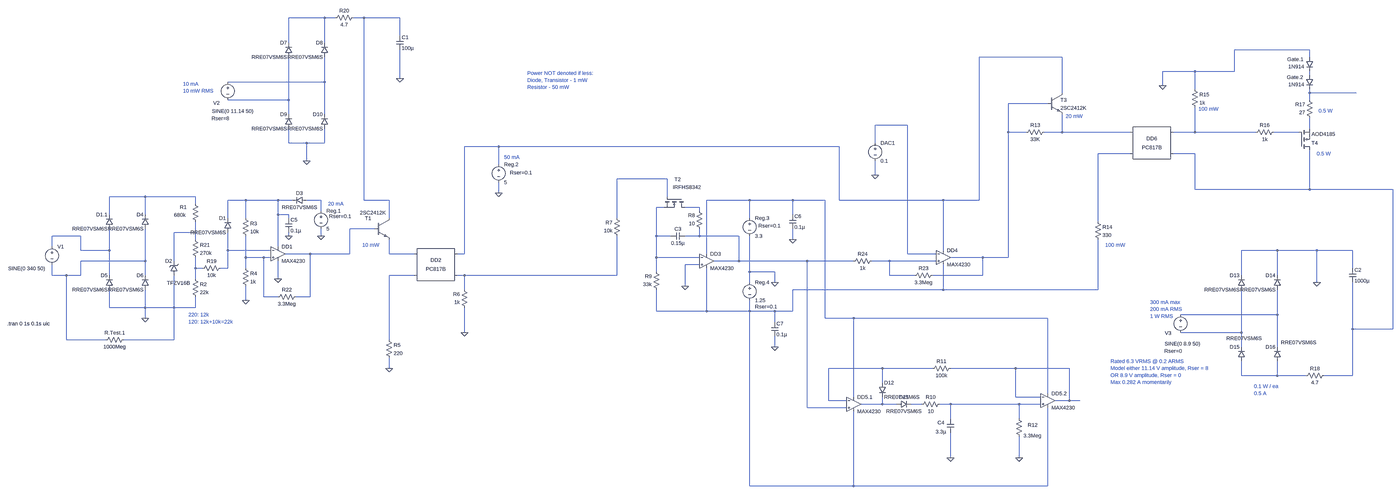
[diagram p0: schematic thyristor.asc, whole sheet]
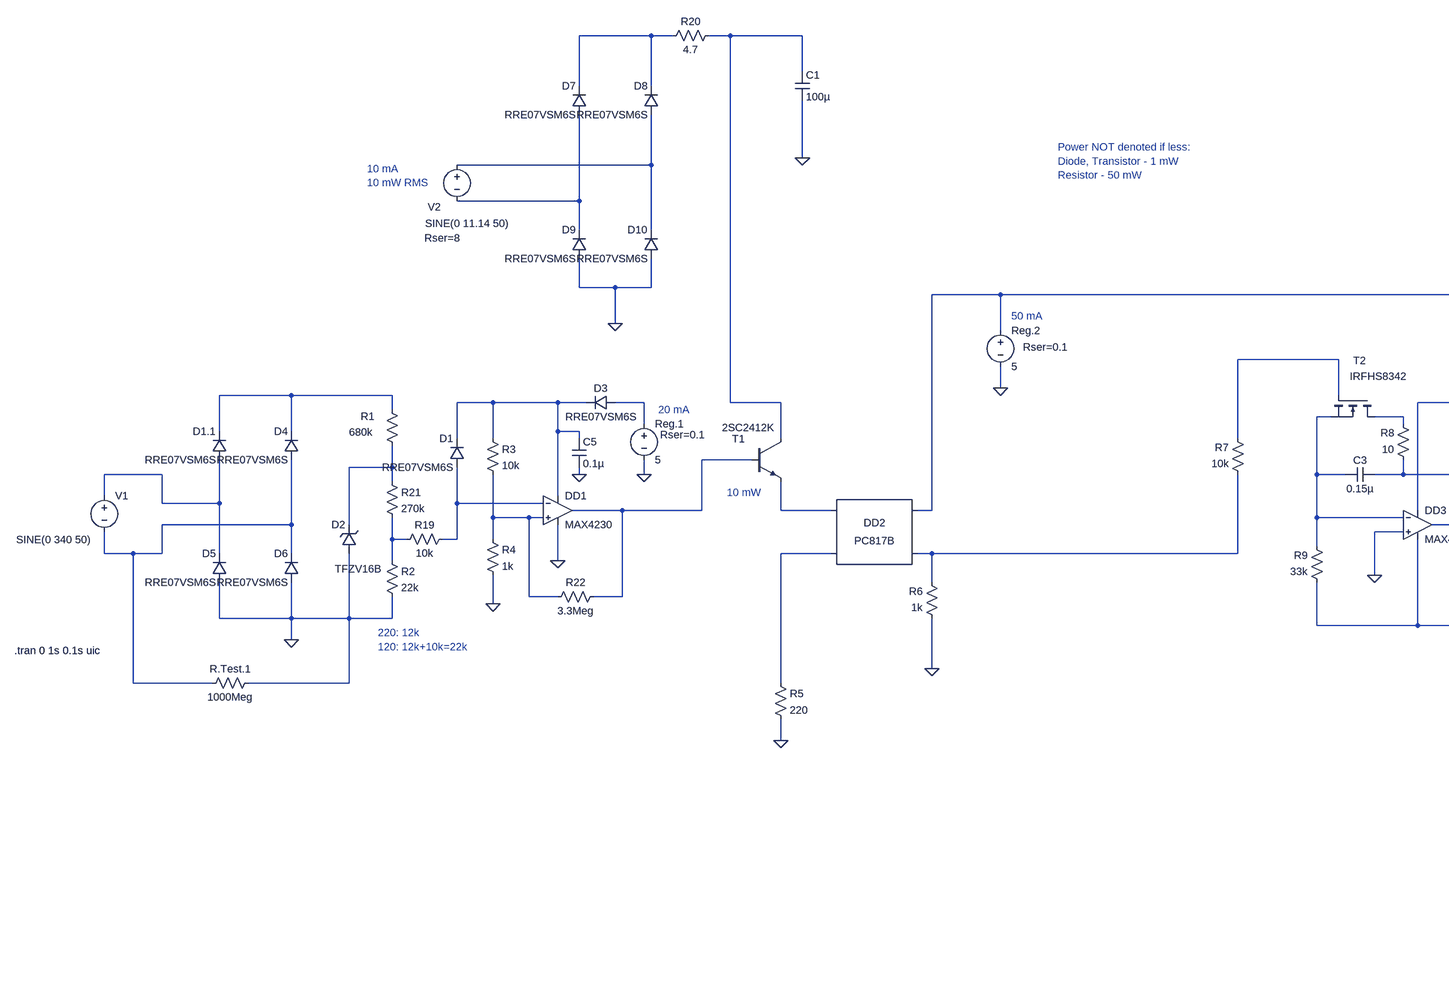
[diagram p1: schematic thyristor.asc, part, row 1 of 1, column 1 of 2]
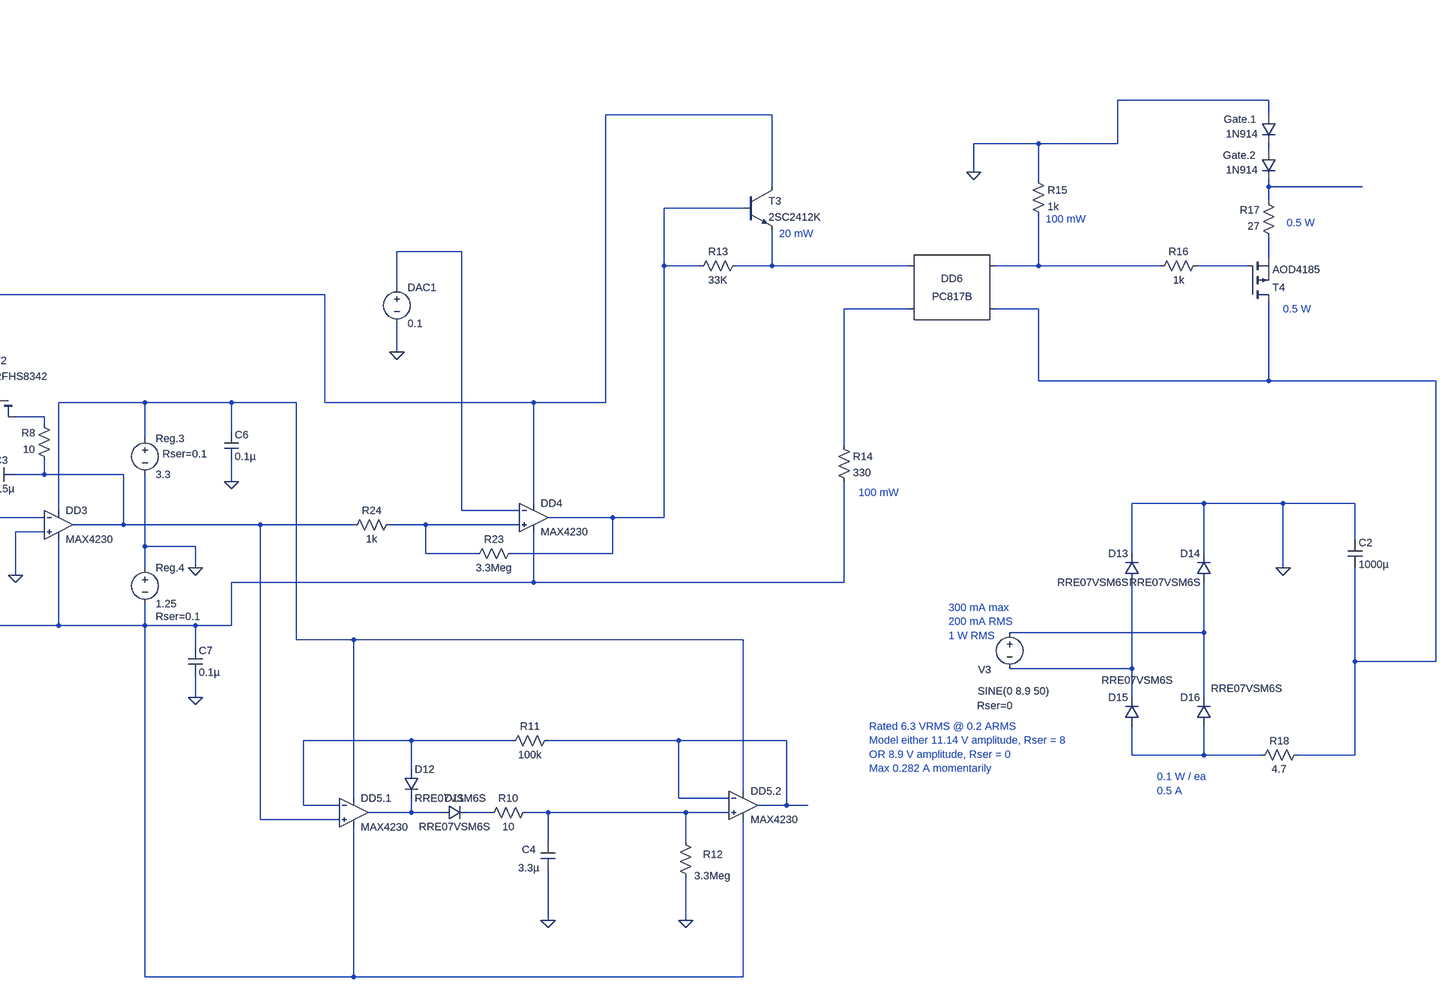
[diagram p2: schematic thyristor.asc, part, row 1 of 1, column 2 of 2]
thyristor.asc, the LTspice schematic file:
Version 4
SHEET 1 5092 984
WIRE -256 -1136 -416 -1136
WIRE -208 -1136 -256 -1136
WIRE -80 -1136 -128 -1136
WIRE 80 -1136 -80 -1136
WIRE 80 -1056 80 -1136
WIRE -416 -1024 -416 -1136
WIRE -256 -1024 -256 -1136
WIRE 4608 -992 4272 -992
WIRE 3504 -960 3024 -960
WIRE 4608 -960 4608 -992
WIRE 4096 -896 3952 -896
WIRE 4272 -896 4272 -992
WIRE 4272 -896 4096 -896
WIRE 4608 -880 4608 -896
WIRE 80 -864 80 -992
WIRE -256 -848 -256 -960
WIRE -256 -848 -688 -848
WIRE 3952 -832 3952 -896
WIRE 4096 -816 4096 -896
WIRE 3504 -800 3504 -960
WIRE 4608 -800 4608 -816
WIRE 4816 -800 4608 -800
WIRE -416 -768 -416 -960
WIRE -416 -768 -688 -768
WIRE 4608 -768 4608 -800
WIRE 3440 -752 3264 -752
WIRE -416 -704 -416 -768
WIRE -256 -704 -256 -848
WIRE 2704 -656 2560 -656
WIRE 4608 -640 4608 -688
WIRE 3264 -624 3264 -752
WIRE 3344 -624 3264 -624
WIRE 3504 -624 3504 -704
WIRE 3504 -624 3424 -624
WIRE 3808 -624 3504 -624
WIRE 4096 -624 4096 -736
WIRE 4096 -624 4000 -624
WIRE 4368 -624 4096 -624
WIRE 4560 -624 4448 -624
WIRE -416 -576 -416 -640
WIRE -336 -576 -416 -576
WIRE -256 -576 -256 -640
WIRE -256 -576 -336 -576
WIRE 2560 -576 2560 -656
WIRE 832 -560 368 -560
WIRE 2400 -560 832 -560
WIRE 3808 -528 3664 -528
WIRE 4096 -528 4000 -528
WIRE -336 -496 -336 -576
WIRE 832 -480 832 -560
WIRE 2560 -432 2560 -496
WIRE 1632 -416 1360 -416
WIRE 4096 -368 4096 -528
WIRE 4608 -368 4608 -544
WIRE 4608 -368 4096 -368
WIRE 5088 -368 4608 -368
WIRE 832 -352 832 -400
WIRE -1056 -336 -1216 -336
WIRE -832 -336 -1056 -336
WIRE 1632 -336 1632 -416
WIRE -608 -320 -688 -320
WIRE -464 -320 -608 -320
WIRE -400 -320 -464 -320
WIRE -272 -320 -336 -320
WIRE -80 -320 -80 -1136
WIRE 32 -320 -80 -320
WIRE 2000 -320 1808 -320
WIRE 2192 -320 2000 -320
WIRE 2336 -320 2192 -320
WIRE 2400 -320 2400 -560
WIRE 2864 -320 2400 -320
WIRE 3024 -320 3024 -960
WIRE 3024 -320 2864 -320
WIRE -832 -304 -832 -336
WIRE 1616 -288 1584 -288
WIRE 1776 -288 1712 -288
WIRE -272 -272 -272 -320
WIRE 1776 -272 1776 -288
WIRE -1216 -256 -1216 -336
WIRE -1056 -256 -1056 -336
WIRE -464 -256 -464 -320
WIRE -416 -256 -464 -256
WIRE 2192 -256 2192 -320
WIRE -688 -240 -688 -320
WIRE -608 -240 -608 -320
WIRE -416 -240 -416 -256
WIRE 32 -240 32 -320
WIRE 1360 -240 1360 -416
WIRE 2000 -240 2000 -320
WIRE 3664 -224 3664 -528
WIRE -32 -192 -144 -192
WIRE -832 -176 -832 -224
WIRE -832 -176 -928 -176
WIRE -1344 -160 -1472 -160
WIRE -416 -160 -416 -176
WIRE -272 -160 -272 -192
WIRE 1584 -160 1584 -288
WIRE 1648 -160 1584 -160
WIRE 1776 -160 1776 -192
WIRE 1776 -160 1712 -160
WIRE 1952 -160 1776 -160
WIRE -832 -144 -832 -176
WIRE 2192 -144 2192 -192
WIRE -1472 -112 -1472 -160
WIRE -464 -112 -464 -256
WIRE -1344 -96 -1344 -160
WIRE -1216 -96 -1216 -192
WIRE -1216 -96 -1344 -96
WIRE -688 -96 -688 -176
WIRE -496 -96 -688 -96
WIRE 2864 -96 2864 -320
WIRE 4464 -96 4304 -96
WIRE 4640 -96 4464 -96
WIRE 4800 -96 4640 -96
WIRE -320 -80 -432 -80
WIRE -144 -80 -144 -192
WIRE -144 -80 -320 -80
WIRE 32 -80 32 -144
WIRE 144 -80 32 -80
WIRE 368 -80 368 -560
WIRE 368 -80 336 -80
WIRE 1808 -80 1808 -320
WIRE 2704 -80 2704 -656
WIRE 2832 -80 2704 -80
WIRE -608 -64 -608 -160
WIRE -528 -64 -608 -64
WIRE -496 -64 -528 -64
WIRE 1584 -64 1584 -160
WIRE 1776 -64 1584 -64
WIRE 3040 -64 2896 -64
WIRE 3264 -64 3264 -624
WIRE 3264 -64 3040 -64
WIRE -1056 -48 -1056 -192
WIRE -1056 -48 -1344 -48
WIRE -928 -48 -928 -176
WIRE 1952 -48 1952 -160
WIRE 1952 -48 1840 -48
WIRE 2256 -48 1952 -48
WIRE 2464 -48 2256 -48
WIRE 2624 -48 2544 -48
WIRE 2832 -48 2624 -48
WIRE 1776 -32 1712 -32
WIRE -832 -16 -832 -64
WIRE -800 -16 -832 -16
WIRE -688 -16 -688 -96
WIRE -688 -16 -720 -16
WIRE -608 -16 -608 -64
WIRE 4800 -16 4800 -96
WIRE 1584 0 1584 -64
WIRE 2000 0 2000 -160
WIRE 2112 0 2000 0
WIRE -1472 16 -1472 -32
WIRE -1408 16 -1472 16
WIRE -1344 16 -1344 -48
WIRE -1344 16 -1408 16
WIRE -1216 16 -1216 -96
WIRE -1056 16 -1056 -48
WIRE 144 16 32 16
WIRE 368 16 336 16
WIRE 1360 16 1360 -160
WIRE 1360 16 368 16
WIRE 2624 16 2624 -48
WIRE 2736 16 2624 16
WIRE 3040 16 3040 -64
WIRE 3040 16 2816 16
WIRE 4304 16 4304 -96
WIRE 4464 16 4464 -96
WIRE -832 32 -832 -16
WIRE -464 32 -464 -48
WIRE 2000 48 2000 0
WIRE 2112 48 2112 0
WIRE 4640 48 4640 -96
WIRE 1712 64 1712 -32
WIRE 368 80 368 16
WIRE 2864 80 2864 -32
WIRE 2864 80 2192 80
WIRE 3664 80 3664 -144
WIRE 3664 80 2864 80
WIRE -528 112 -528 -64
WIRE -464 112 -528 112
WIRE -320 112 -320 -80
WIRE -320 112 -384 112
WIRE -608 128 -608 64
WIRE -1216 160 -1216 80
WIRE -1056 160 -1056 80
WIRE -1056 160 -1216 160
WIRE -928 160 -928 16
WIRE -928 160 -1056 160
WIRE -832 160 -832 112
WIRE -832 160 -928 160
WIRE 1584 176 1584 80
WIRE 1808 176 1808 -16
WIRE 1808 176 1584 176
WIRE 2000 176 2000 128
WIRE 2000 176 1808 176
WIRE 2112 176 2000 176
WIRE 2192 176 2192 80
WIRE 2192 176 2112 176
WIRE 4464 192 4464 80
WIRE 4464 192 4032 192
WIRE -1056 208 -1056 160
WIRE 2336 208 2336 -320
WIRE 2464 208 2336 208
WIRE 3440 208 2464 208
WIRE 2112 224 2112 176
WIRE 4800 256 4800 48
WIRE 5088 256 5088 -368
WIRE 5088 256 4800 256
WIRE 368 272 368 160
WIRE 4304 272 4304 80
WIRE 4304 272 4032 272
WIRE -1408 304 -1408 16
WIRE -1232 304 -1408 304
WIRE -928 304 -928 160
WIRE -928 304 -1152 304
WIRE 32 304 32 16
WIRE 2112 336 2112 288
WIRE 4304 336 4304 272
WIRE 4464 336 4464 192
WIRE 32 432 32 384
WIRE 2592 432 2352 432
WIRE 2816 432 2592 432
WIRE 3296 432 2896 432
WIRE 3536 432 3296 432
WIRE 4304 464 4304 400
WIRE 4464 464 4464 400
WIRE 4464 464 4304 464
WIRE 4592 464 4464 464
WIRE 4800 464 4800 256
WIRE 4800 464 4672 464
WIRE 2592 496 2592 432
WIRE 3440 544 3440 208
WIRE 2464 560 2464 208
WIRE 3296 560 3296 432
WIRE 3408 560 3296 560
WIRE 2352 576 2352 432
WIRE 2432 576 2352 576
WIRE 3536 576 3536 432
WIRE 3536 576 3472 576
WIRE 3584 576 3536 576
WIRE 2592 592 2592 560
WIRE 2592 592 2496 592
WIRE 2656 592 2592 592
WIRE 2768 592 2720 592
WIRE 2896 592 2848 592
WIRE 3312 592 2896 592
WIRE 3408 592 3312 592
WIRE 2256 608 2256 -48
WIRE 2432 608 2256 608
WIRE 2896 656 2896 592
WIRE 3312 656 3312 592
WIRE 2896 832 2896 720
WIRE 3312 832 3312 736
WIRE 2000 976 2000 176
WIRE 2464 976 2464 624
WIRE 2464 976 2000 976
WIRE 3440 976 3440 608
WIRE 3440 976 2464 976
FLAG -1056 208 0
FLAG -608 128 0
FLAG -464 32 0
FLAG 2112 48 0
FLAG 1712 64 0
FLAG 2560 -432 0
FLAG 2896 832 0
FLAG 3312 832 0
FLAG 32 432 0
FLAG 368 272 0
FLAG 3952 -832 0
FLAG -336 -496 0
FLAG 80 -864 0
FLAG 4640 48 0
FLAG 832 -352 0
FLAG -272 -160 0
FLAG -416 -160 0
FLAG 2192 -144 0
FLAG 2112 336 0
SYMBOL voltage -1472 -128 R0
WINDOW 3 -196 113 Left 2
WINDOW 123 0 0 Left 0
WINDOW 39 0 0 Left 0
SYMATTR Value SINE(0 340 50)
SYMATTR InstName V1
SYMBOL voltage 2000 -256 R0
WINDOW 123 0 0 Left 0
WINDOW 39 39 50 Left 2
SYMATTR SpiceLine Rser=0.1
SYMATTR InstName Reg.3
SYMATTR Value 3.3
SYMBOL voltage 2000 32 R0
WINDOW 123 0 0 Left 0
WINDOW 39 24 124 Left 2
SYMATTR SpiceLine Rser=0.1
SYMATTR InstName Reg.4
SYMATTR Value 1.25
SYMBOL diode -1200 -192 R180
WINDOW 0 24 64 Left 2
WINDOW 3 24 0 Left 2
SYMATTR InstName D1.1
SYMATTR Value RRE07VSM6S
SYMBOL res -848 -320 R0
WINDOW 0 -54 31 Left 2
WINDOW 3 -80 66 Left 2
SYMATTR InstName R1
SYMATTR Value 680k
SYMATTR SpiceLine pwr=0.25
SYMBOL res -848 16 R0
SYMATTR InstName R2
SYMATTR Value 22k
SYMBOL res -624 -256 R0
SYMATTR InstName R3
SYMATTR Value 10k
SYMBOL res -624 -32 R0
SYMATTR InstName R4
SYMATTR Value 1k
SYMBOL res 1600 96 R180
WINDOW 0 36 76 Left 2
WINDOW 3 36 40 Left 2
SYMATTR InstName R9
SYMATTR Value 33k
SYMBOL cap 1712 -176 R90
WINDOW 0 0 32 VBottom 2
WINDOW 3 32 32 VTop 2
SYMATTR InstName C3
SYMATTR Value 0.15µ
SYMBOL voltage 2560 -592 R0
WINDOW 123 0 0 Left 0
WINDOW 39 0 0 Left 0
SYMATTR InstName DAC1
SYMATTR Value 0.1
SYMBOL nmos 1712 -336 R90
WINDOW 3 -42 -71 VRight 2
WINDOW 0 -77 19 VRight 2
SYMATTR Value IRFHS8342
SYMATTR InstName T2
SYMBOL res 2752 608 R270
WINDOW 0 32 56 VTop 2
WINDOW 3 0 56 VBottom 2
SYMATTR InstName R10
SYMATTR Value 10
SYMBOL cap 2880 656 R0
WINDOW 0 -42 18 Left 2
WINDOW 3 -50 59 Left 2
SYMATTR InstName C4
SYMATTR Value 3.3µ
SYMBOL res 2800 448 R270
WINDOW 0 32 56 VTop 2
WINDOW 3 0 56 VBottom 2
SYMATTR InstName R11
SYMATTR Value 100k
SYMBOL OpAmps\\MAX4230 1808 -112 R0
SYMATTR InstName DD3
SYMBOL res 3328 752 R180
WINDOW 0 -67 67 Left 2
WINDOW 3 -84 19 Left 2
SYMATTR InstName R12
SYMATTR Value 3.3Meg
SYMBOL Optos\\PC817B 240 -32 R0
SYMATTR InstName DD2
SYMBOL res 16 288 R0
SYMATTR InstName R5
SYMATTR Value 220
SYMBOL Optos\\PC817B 3904 -576 R0
SYMATTR InstName DD6
SYMBOL res 4080 -832 R0
SYMATTR InstName R15
SYMATTR Value 1k
SYMBOL res 4624 -672 R180
WINDOW 0 36 76 Left 2
WINDOW 3 36 40 Left 2
SYMATTR InstName R17
SYMATTR Value 27
SYMBOL pmos 4560 -544 M180
SYMATTR InstName T4
SYMATTR Value AOD4185
SYMBOL diode 4592 -880 R0
WINDOW 0 -86 10 Left 2
WINDOW 3 -79 43 Left 2
SYMATTR InstName Gate.2
SYMATTR Value 1N914
SYMBOL npn -32 -240 R0
WINDOW 0 -44 1 Left 2
WINDOW 3 -67 -24 Left 2
SYMATTR InstName T1
SYMATTR Value 2SC2412K
SYMBOL res 1376 -144 R180
WINDOW 0 36 76 Left 2
WINDOW 3 36 40 Left 2
SYMATTR InstName R7
SYMATTR Value 10k
SYMBOL res 384 176 R180
WINDOW 0 36 76 Left 2
WINDOW 3 36 40 Left 2
SYMATTR InstName R6
SYMATTR Value 1k
SYMBOL voltage -688 -864 R0
WINDOW 123 0 0 Left 0
WINDOW 39 -72 178 Left 2
WINDOW 0 -65 109 Left 2
WINDOW 3 -71 146 Left 2
SYMATTR SpiceLine Rser=8
SYMATTR InstName V2
SYMATTR Value SINE(0 11.14 50)
SYMBOL cap 64 -1056 R0
SYMATTR InstName C1
SYMATTR Value 100µ
SYMBOL res 1792 -176 R180
WINDOW 0 36 76 Left 2
WINDOW 3 36 40 Left 2
SYMATTR InstName R8
SYMATTR Value 10
SYMBOL res 3648 -240 R0
SYMATTR InstName R14
SYMATTR Value 330
SYMBOL npn 3440 -800 R0
SYMATTR InstName T3
SYMATTR Value 2SC2412K
SYMBOL res 4352 -608 R270
WINDOW 0 32 56 VTop 2
WINDOW 3 0 56 VBottom 2
SYMATTR InstName R16
SYMATTR Value 1k
SYMBOL voltage 4032 176 R0
WINDOW 123 0 0 Left 0
WINDOW 39 -72 178 Left 2
WINDOW 0 -70 98 Left 2
WINDOW 3 -71 146 Left 2
SYMATTR SpiceLine Rser=0
SYMATTR InstName V3
SYMATTR Value SINE(0 8.9 50)
SYMBOL cap 4784 -16 R0
SYMATTR InstName C2
SYMATTR Value 1000µ
SYMBOL diode 4592 -960 R0
WINDOW 0 -84 10 Left 2
WINDOW 3 -79 43 Left 2
SYMATTR InstName Gate.1
SYMATTR Value 1N914
SYMBOL voltage 832 -496 R0
WINDOW 123 0 0 Left 0
WINDOW 39 50 53 Left 2
SYMATTR SpiceLine Rser=0.1
SYMATTR InstName Reg.2
SYMATTR Value 5
SYMBOL OpAmps\\MAX4230 2464 528 R0
SYMATTR InstName DD5.1
SYMBOL OpAmps\\MAX4230 3440 512 R0
SYMATTR InstName DD5.2
SYMBOL voltage -272 -288 R0
WINDOW 123 0 0 Left 0
WINDOW 39 36 40 Left 2
SYMATTR SpiceLine Rser=0.1
SYMATTR InstName Reg.1
SYMATTR Value 5
SYMBOL res 3328 -608 R270
WINDOW 0 32 56 VTop 2
WINDOW 3 0 56 VBottom 2
SYMATTR InstName R13
SYMATTR Value 33K
SYMBOL res -1248 320 R270
WINDOW 0 32 56 VTop 2
WINDOW 3 0 56 VBottom 2
SYMATTR InstName R.Test.1
SYMATTR Value 1000Meg
SYMBOL res 4576 480 R270
WINDOW 0 32 56 VTop 2
WINDOW 3 0 56 VBottom 2
SYMATTR InstName R18
SYMATTR Value 4.7
SYMBOL res -224 -1120 R270
WINDOW 0 32 56 VTop 2
WINDOW 3 0 56 VBottom 2
SYMATTR InstName R20
SYMATTR Value 4.7
SYMBOL zener -912 16 R180
WINDOW 0 24 64 Left 2
WINDOW 3 -56 -34 Left 2
SYMATTR InstName D2
SYMATTR Value TFZV16B
SYMBOL cap -432 -240 R0
SYMATTR InstName C5
SYMATTR Value 0.1µ
SYMBOL res -816 0 R270
WINDOW 0 32 56 VTop 2
WINDOW 3 0 56 VBottom 2
SYMATTR InstName R19
SYMATTR Value 10k
SYMBOL res -848 -160 R0
SYMATTR InstName R21
SYMATTR Value 270k
SYMBOL diode -1040 -192 R180
WINDOW 0 24 64 Left 2
WINDOW 3 24 0 Left 2
SYMATTR InstName D4
SYMATTR Value RRE07VSM6S
SYMBOL diode -1200 80 R180
WINDOW 0 24 64 Left 2
WINDOW 3 24 0 Left 2
SYMATTR InstName D5
SYMATTR Value RRE07VSM6S
SYMBOL diode -1040 80 R180
WINDOW 0 24 64 Left 2
WINDOW 3 24 0 Left 2
SYMATTR InstName D6
SYMATTR Value RRE07VSM6S
SYMBOL diode -400 -960 R180
WINDOW 0 24 64 Left 2
WINDOW 3 24 0 Left 2
SYMATTR InstName D7
SYMATTR Value RRE07VSM6S
SYMBOL diode -240 -960 R180
WINDOW 0 24 64 Left 2
WINDOW 3 24 0 Left 2
SYMATTR InstName D8
SYMATTR Value RRE07VSM6S
SYMBOL diode -400 -640 R180
WINDOW 0 24 64 Left 2
WINDOW 3 24 0 Left 2
SYMATTR InstName D9
SYMATTR Value RRE07VSM6S
SYMBOL diode -240 -640 R180
WINDOW 0 24 64 Left 2
WINDOW 3 24 0 Left 2
SYMATTR InstName D10
SYMATTR Value RRE07VSM6S
SYMBOL diode -672 -176 R180
WINDOW 0 24 64 Left 2
WINDOW 3 24 0 Left 2
SYMATTR InstName D1
SYMATTR Value RRE07VSM6S
SYMBOL diode -336 -336 R90
WINDOW 0 0 32 VBottom 2
WINDOW 3 32 32 VTop 2
SYMATTR InstName D3
SYMATTR Value RRE07VSM6S
SYMBOL diode 2656 608 R270
WINDOW 0 32 32 VTop 2
WINDOW 3 0 32 VBottom 2
SYMATTR InstName D11
SYMATTR Value RRE07VSM6S
SYMBOL diode 2576 496 R0
SYMATTR InstName D12
SYMATTR Value RRE07VSM6S
SYMBOL diode 4320 80 R180
WINDOW 0 24 64 Left 2
WINDOW 3 24 0 Left 2
SYMATTR InstName D13
SYMATTR Value RRE07VSM6S
SYMBOL diode 4480 80 R180
WINDOW 0 24 64 Left 2
WINDOW 3 24 0 Left 2
SYMATTR InstName D14
SYMATTR Value RRE07VSM6S
SYMBOL diode 4320 400 R180
WINDOW 0 24 64 Left 2
WINDOW 3 -75 102 Left 2
SYMATTR InstName D15
SYMATTR Value RRE07VSM6S
SYMBOL diode 4480 400 R180
WINDOW 0 24 64 Left 2
WINDOW 3 -158 84 Left 2
SYMATTR InstName D16
SYMATTR Value RRE07VSM6S
SYMBOL OpAmps\\MAX4230 2864 -128 R0
SYMATTR InstName DD4
SYMBOL cap 2176 -256 R0
SYMATTR InstName C6
SYMATTR Value 0.1µ
SYMBOL cap 2096 224 R0
SYMATTR InstName C7
SYMATTR Value 0.1µ
SYMBOL OpAmps\\MAX4230 -464 -144 R0
SYMATTR InstName DD1
SYMBOL res -480 128 R270
WINDOW 0 32 56 VTop 2
WINDOW 3 0 56 VBottom 2
SYMATTR InstName R22
SYMATTR Value 3.3Meg
SYMBOL res 2720 32 R270
WINDOW 0 32 56 VTop 2
WINDOW 3 0 56 VBottom 2
SYMATTR InstName R23
SYMATTR Value 3.3Meg
SYMBOL res 2448 -32 R270
WINDOW 0 32 56 VTop 2
WINDOW 3 0 56 VBottom 2
SYMATTR InstName R24
SYMATTR Value 1k
TEXT -1672 232 Left 2 !.tran 0 1s 0.1s uic
TEXT 4360 512 Left 2 ;0.1 W / ea\n0.5 A
TEXT 4648 -720 Left 2 ;0.5 W
TEXT -88 -120 Left 2 ;10 mW
TEXT 4640 -528 Left 2 ;0.5 W
TEXT -240 -304 Left 2 ;20 mA
TEXT 856 -512 Left 2 ;50 mA
TEXT 3520 -696 Left 2 ;20 mW
TEXT 3896 136 Left 2 ;300 mA max\n200 mA RMS\n1 W RMS
TEXT -888 -840 Left 2 ;10 mA\n10 mW RMS
TEXT 960 -888 Left 2 ;Power NOT denoted if less:\nDiode, Transistor - 1 mW\nResistor - 50 mW
TEXT 3696 -120 Left 2 ;100 mW
TEXT 4112 -728 Left 2 ;100 mW
TEXT -864 192 Left 2 ;220: 12k\n120: 12k+10k=22k
TEXT 3720 400 Left 2 ;Rated 6.3 VRMS @ 0.2 ARMS\nModel either 11.14 V amplitude, Rser = 8\nOR 8.9 V amplitude, Rser = 0\nMax 0.282 A momentarily

The netlist it stands for:
* thyristor.asc
V1 N025 N030 SINE(0 340 50)
V§Reg.3 N020 0 3.3 Rser=0.1
V§Reg.4 0 N035 1.25 Rser=0.1
D1.1 N025 N017 RRE07VSM6S
R1 N017 N024 680k pwr=0.25
R2 N032 0 22k
R3 N018 N029 10k
R4 N029 0 1k
R9 N035 N021 33k
C3 N026 N021 0.15µ
V§DAC1 N009 0 0.1
M§T2 N022 N016 N021 N021 IRFHS8342
R10 N042 N043 10
C4 N043 0 3.3µ
R11 N038 N039 100k
XDD3 0 N021 N020 N035 N026 MAX4230  ; pins In+ In- V+ V- OUT
R12 0 N043 3.3Meg
XDD2 N028 N033 N003 N034 PC817 Igain=1.5m
R5 N033 0 220
XDD6 N011 N014 N012 N015 PC817 Igain=1.5m
R15 0 N012 1k
R17 N010 N006 27
M§T4 N015 N013 N010 N010 AOD4185
D§Gate.2 N004 N006 1N914
Q§T1 N002 N023 N028 0 2SC2412K
R7 N034 N016 10k
R6 0 N034 1k
V2 N005 N007 SINE(0 11.14 50) Rser=8
C1 N002 0 100µ
R8 N026 N022 10
R14 N014 N035 330
Q§T3 N003 N008 N011 0 2SC2412K
R16 N012 N013 1k
V3 N036 N037 SINE(0 8.9 50) Rser=0
C2 0 N015 1000µ
D§Gate.1 0 N004 1N914
V§Reg.2 N003 0 5 Rser=0.1
XDD5.1 N026 N038 N020 N035 N041 MAX4230  ; pins In+ In- V+ V- OUT
XDD5.2 N043 N039 N020 N035 N039 MAX4230  ; pins In+ In- V+ V- OUT
V§Reg.1 N019 0 5 Rser=0.1
R13 N008 N011 33K
R.Test.1 N030 0 1000Meg
R18 N040 N015 4.7
R20 N001 N002 4.7
D2 0 N024 TFZV16B
C5 N018 0 0.1µ
R19 N032 N027 10k
R21 N024 N032 270k
D4 N030 N017 RRE07VSM6S
D5 0 N025 RRE07VSM6S
D6 0 N030 RRE07VSM6S
D7 N007 N001 RRE07VSM6S
D8 N005 N001 RRE07VSM6S
D9 0 N007 RRE07VSM6S
D10 0 N005 RRE07VSM6S
D1 N027 N018 RRE07VSM6S
D3 N019 N018 RRE07VSM6S
D11 N041 N042 RRE07VSM6S
D12 N038 N041 RRE07VSM6S
D13 N037 0 RRE07VSM6S
D14 N036 0 RRE07VSM6S
D15 N040 N037 RRE07VSM6S
D16 N040 N036 RRE07VSM6S
XDD4 N031 N009 N003 N035 N008 MAX4230  ; pins In+ In- V+ V- OUT
C6 N020 0 0.1µ
C7 N035 0 0.1µ
XDD1 N029 N027 N018 0 N023 MAX4230  ; pins In+ In- V+ V- OUT
R22 N029 N023 3.3Meg
R23 N031 N008 3.3Meg
R24 N026 N031 1k
.model D D
.lib standard.dio
.model NPN NPN
.model PNP PNP
.lib standard.bjt
.model NMOS NMOS
.model PMOS PMOS
.lib standard.mos
.tran 0 1s 0.1s uic
* 0.1 W / ea
* 0.5 A
* 0.5 W
* 10 mW
* 0.5 W
* 20 mA
* 50 mA
* 20 mW
* 300 mA max
* 200 mA RMS
* 1 W RMS
* 10 mA
* 10 mW RMS
* Power NOT denoted if less:
* Diode, Transistor - 1 mW
* Resistor - 50 mW
* 100 mW
* 100 mW
* 220: 12k
* 120: 12k+10k=22k
* Rated 6.3 VRMS @ 0.2 ARMS
* Model either 11.14 V amplitude, Rser = 8
* OR 8.9 V amplitude, Rser = 0
* Max 0.282 A momentarily
.lib MAX4230.lib
.lib PC817.sub
.backanno
.end